# Altium schematic sheet STM32F103RB&DAC&VI.SchDoc
size A4
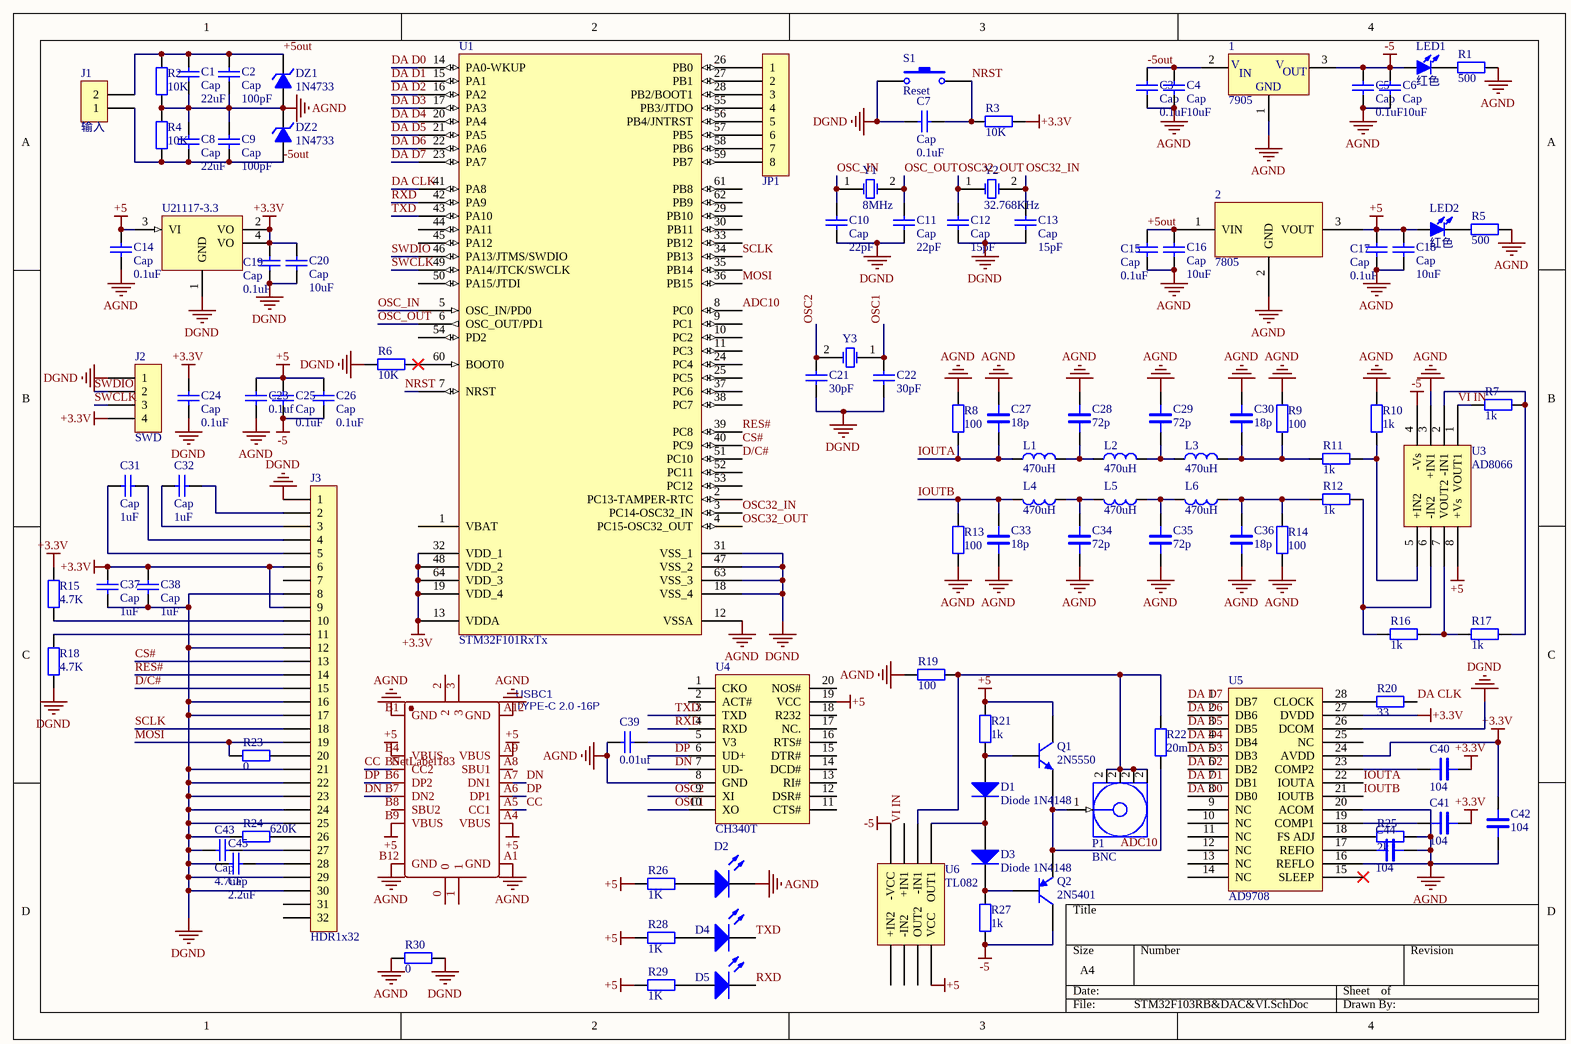
[diagram p0: STM32F103RB&DAC&VI.SchDoc]

## Parts
1  7905  [TO-220AB]
2  7805  [TO-220AB]
C1  Cap  value 22uF  [0603_C]
C2  Cap  value 100pF  [0603_C]
C3  Cap  value 0.1uF  [0603_C]
C4  Cap  value 10uF  [0603_C]
C5  Cap  value 0.1uF  [0603_C]
C6  Cap  value 10uF  [0603_C]
C7  Cap  value 0.1uF  [0603_C]
C8  Cap  value 22uF  [0603_C]
C9  Cap  value 100pF  [0603_C]
C10  Cap  value 22pF  [0603_C]
C11  Cap  value 22pF  [0603_C]
C12  Cap  value 15pF  [0603_C]
C13  Cap  value 15pF  [0603_C]
C14  Cap  value 0.1uF  [0603_C]
C15  Cap  value 0.1uF  [0603_C]
C16  Cap  value 10uF  [0603_C]
C17  Cap  value 0.1uF  [0603_C]
C18  Cap  value 10uF  [0603_C]
C19  Cap  value 0.1uF  [0603_C]
C20  Cap  value 10uF  [0603_C]
C21  value 30pF  [0603_C]  (hidden comment: Cap)
C22  value 30pF  [0603_C]  (hidden comment: Cap)
C23  value 0.1uf  [0603_C]  (hidden comment: Cap)
C24  Cap  value 0.1uF  [0603_C]
C25  Cap  value 0.1uF  [0603_C]
C26  Cap  value 0.1uF  [0603_C]
C27  18p  [0603_C]
C28  72p  [0603_C]
C29  72p  [0603_C]
C30  18p  [0603_C]
C31  Cap  value 1uF  [0603_C]
C32  Cap  value 1uF  [0603_C]
C33  18p  [0603_C]
C34  72p  [0603_C]
C35  72p  [0603_C]
C36  18p  [0603_C]
C37  Cap  value 1uF  [0603_C]
C38  Cap  value 1uF  [0603_C]
C39  value 0.01uf  [0603_C]  (hidden comment: Cap)
C40  104  [0603_C]
C41  104  [0603_C]
C42  104  [0603_C]
C43  Cap  value 4.7uF  [0603_C]
C44  104  [0603_C]
C45  Cap  value 2.2uF  [0603_C]
D1  Diode 1N4148  [DO-35]
D2  LED  [LED 0603B]  (value not drawn)
D3  Diode 1N4148  [DO-35]
D4  LED  [LED 0603B]  (value not drawn)
D5  LED  [LED 0603B]  (value not drawn)
DZ1  1N4733  [DO-41]
DZ2  1N4733  [DO-41]
J1  输入  [PH2.0-WS-2P]
J2  SWD  [PH2.0-WS-4P]
J3  HDR1x32  [FPC0.5 2H-WS-30P]
JP1  FPC1.0-8P  [FPC1.0-2H-WS-8P]  (value not drawn)
L1  470uH  [0805_L]
L2  470uH  [0805_L]
L3  470uH  [0805_L]
L4  470uH  [0805_L]
L5  470uH  [0805_L]
L6  470uH  [0805_L]
LED1  红色  [LED 0603B]
LED2  红色  [LED 0603B]
P1  BNC  [BNC]
Q1  2N5550  [TO-92A]
Q2  2N5401  [TO-92A]
R1  value 500  [0603_R]  (hidden comment: 1W)
R2  10K  [0603_R]
R3  value 10K  [0603_R]  (hidden comment: 1W)
R4  10K  [0603_R]
R5  value 500  [0603_R]  (hidden comment: 1W)
R6  value 10K  [0603_R]  (hidden comment: 1W)
R7  1k  [0603_R]
R8  100  [0603_R]
R9  100  [0603_R]
R10  1k  [0603_R]
R11  1k  [0603_R]
R12  1k  [0603_R]
R13  100  [0603_R]
R14  100  [0603_R]
R15  value 4.7K  [0603_R]  (hidden comment: 1W)
R16  1k  [0603_R]
R17  1k  [0603_R]
R18  value 4.7K  [0603_R]  (hidden comment: 1W)
R19  100  [0603_R]
R20  33  [0603_R]
R21  1k  [0603_R]
R22  20m  [0603_R]
R23  value 0  [0603_R]  (hidden comment: 1W)
R24  value 620K  [0603_R]  (hidden comment: 1W)
R25  2k  [0603_R]
R26  value 1K  [0603_R]  (hidden comment: Res2)
R27  1k  [0603_R]
R28  value 1K  [0603_R]  (hidden comment: Res2)
R29  value 1K  [0603_R]  (hidden comment: Res2)
R30  value 0  [0603_R]  (hidden comment: Res2)
S1  Reset  [3*6*2.5SW-PB]
U1  STM32F101RxTx  [QFP-64-0.5]
U2  1117-3.3  [SOT-223]
U3  AD8066  [SOIC-8_150mil]
U4  CH340T  [SSOP-20_208mil]
U5  AD9708  [SOIC-28_300mil]
U6  TL082  [SOIC-8_150mil]
USBC1  TYPE-C 2.0 -16P  [USB-C-SMD_TYPE-C-USB-5]
Y1  8MHz  [OSC 5032-2P]
Y2  32.768KHz  [OSC 3215-2P]
Y3  XTAL  [OSC 5032-2P]  (value not drawn)

## Nets
+3.3V: C19.2 C20.2 C24.2 C37.2 C38.2 C40.2 C41.2 C42.2 J2.4 J3.6 J3.9 R3.1 R15.2 U1.13(VDDA) U1.19(VDD_4) U1.32(VDD_1) U1.48(VDD_2) U1.64(VDD_3) U2.2(VO) U2.4(VO) U5.24(AVDD) U5.27(DVDD)
+5: 2.3(VOUT) C14.2 C17.2 C18.2 C23.1 C25.2 C26.2 LED2.1(A) Q1.3(C) R21.1 R26.1 R28.1 R29.1 U2.3(VI) U3.8(+Vs) U4.19(VCC) U6.8(VCC) USBC1.A4(VBUS) USBC1.A9(VBUS) USBC1.B4(VBUS) USBC1.B9(VBUS)
-5: 1.3(VOUT) C5.2 C6.2 C25.1 C26.1 LED1.1(A) Q2.3(C) R27.2 U3.4(-Vs) U6.4(-VCC)
AGND: 1.1(GND) 2.2(GND) C1.1 C2.1 C3.1 C4.1 C5.1 C6.1 C8.2 C9.2 C14.1 C15.1 C16.1 C17.1 C18.1 C23.2 C27.2 C28.2 C29.2 C30.2 C33.2 C34.2 C35.2 C36.2 C39.1 C42.1 C44.2 D2.2 DZ1.1(A) DZ2.2(K) R1.1 R2.1 R4.2 R5.1 R8.2 R9.2 R10.1 R13.2 R14.2 R19.1 R25.2 R30.1 U1.12(VSSA) U3.3(+IN1) U4.8(GND) U5.16(REFLO) U5.20(ACOM) USBC1.A1(GND) USBC1.A12(GND) USBC1.B1(GND) USBC1.B12(GND)
DGND: C7.1 C10.1 C11.1 C12.1 C13.1 C19.1 C20.1 C21.2 C22.2 C24.1 C37.1 C38.1 C43.2 C45.2 J2.1 J3.1 J3.8 J3.12 J3.16 J3.17 J3.21 J3.22 J3.23 J3.24 J3.25 J3.29 J3.30 R6.2 R18.1 R24.1 R30.2 S1.1 U1.18(VSS_4) U1.31(VSS_1) U1.47(VSS_2) U1.63(VSS_3) U2.1(GND) U5.26(DCOM)
+5out: 2.1(VIN) C1.2 C2.2 C15.2 C16.2 DZ1.2(K) J1.2 R2.2
-5out: 1.2(VIN) C3.2 C4.2 C8.1 C9.1 DZ2.1(A) J1.1 R4.1
ADC10: P1.1 Q1.1(E) Q2.1(E) R22.1 U1.8(PC0)
CC: USBC1.A5(CC1) USBC1.B5(CC2)  [also labelled NetLabel183]
CS#: J3.13 U1.40(PC9)
D/C#: J3.15 U1.51(PC10)
DA CLK: R20.2 U1.41(PA8)
DA D0: U1.14(PA0-WKUP) U5.8(DB0)
DA D1: U1.15(PA1) U5.7(DB1)
DA D2: U1.16(PA2) U5.6(DB2)
DA D3: U1.17(PA3) U5.5(DB3)
DA D4: U1.20(PA4) U5.4(DB4)
DA D5: U1.21(PA5) U5.3(DB5)
DA D6: U1.22(PA6) U5.2(DB6)
DA D7: U1.23(PA7) U5.1(DB7)
DN: U4.7(UD-) USBC1.A7(DN1) USBC1.B7(DN2)
DP: U4.6(UD+) USBC1.A6(DP1) USBC1.B6(DP2)
IOUTA: C27.1 L1.1 R8.1 U5.22(IOUTA)
IOUTB: C33.1 L4.1 R13.1 U5.21(IOUTB)
MOSI: J3.19 R23.1 U1.36(PB15)
NRST: C7.2 R3.2 S1.2 U1.7(NRST)
OSC1: C22.1 U4.10(XO) Y3.1(OSC1)
OSC2: C21.1 U4.9(XI) Y3.2(OSC2)
OSC32_IN: C13.2 U1.3(PC14-OSC32_IN) Y2.2(OSC2)
OSC32_OUT: C12.2 U1.4(PC15-OSC32_OUT) Y2.1(OSC1)
OSC_IN: C10.2 U1.5(OSC_IN/PD0) Y1.1(OSC1)
OSC_OUT: C11.2 U1.6(OSC_OUT/PD1) Y1.2(OSC2)
RES#: J3.14 U1.39(PC8)
RXD: D5.2 U1.42(PA9) U4.4(RXD)
SCLK: J3.18 U1.34(PB13)
SWCLK: J2.3 U1.49(PA14/JTCK/SWCLK)
SWDIO: J2.2 U1.46(PA13/JTMS/SWDIO)
TXD: D4.2 U1.43(PA10) U4.3(TXD)
VI IN: R7.2 U3.1(VOUT1) U6.3(+IN1)
NetC28_1: C28.1 L1.2 L2.1
NetC29_1: C29.1 L2.2 L3.2
NetC30_1: C30.1 L3.1 R9.1 R11.2
NetC31_1: C31.1 J3.4
NetC31_2: C31.2 J3.5
NetC32_1: C32.1 J3.2
NetC32_2: C32.2 J3.3
NetC34_1: C34.1 L4.2 L5.1
NetC35_1: C35.1 L5.2 L6.2
NetC36_1: C36.1 L6.1 R12.2 R14.1
NetC39_2: C39.2 U4.5(V3)
NetC40_1: C40.1 U5.23(COMP2)
NetC41_1: C41.1 U5.19(COMP1)
NetC43_1: C43.1 J3.27
NetC44_1: C44.1 U5.17(REFIO)
NetC45_1: C45.1 J3.28
NetD1_1: D1.1(A) Q1.2(B) R21.2
NetD1_2: D1.2(K) D3.1(A) U6.1(OUT1)
NetD2_1: D2.1 R26.2
NetD3_2: D3.2(K) Q2.2(B) R27.1
NetD4_1: D4.1 R28.2
NetD5_1: D5.1 R29.2
NetJ3_10: J3.10 R15.1
NetJ3_11: J3.11 R18.2
NetJ3_20: J3.20 R23.2
NetJ3_26: J3.26 R24.2
NetJP1_1: JP1.1 U1.26(PB0)
NetJP1_2: JP1.2 U1.27(PB1)
NetJP1_3: JP1.3 U1.28(PB2/BOOT1)
NetJP1_4: JP1.4 U1.55(PB3/JTDO)
NetJP1_5: JP1.5 U1.56(PB4/JNTRST)
NetJP1_6: JP1.6 U1.57(PB5)
NetJP1_7: JP1.7 U1.58(PB6)
NetJP1_8: JP1.8 U1.59(PB7)
NetLED1_2: LED1.2(K) R1.2
NetLED2_2: LED2.2(K) R5.2
NetP1_2: P1.2 R19.2 R22.2 U6.2(-IN1)
NetR6_1: R6.1 U1.60(BOOT0)
NetR7_1: R7.1 R17.1 U3.2(-IN1)
NetR10_2: R10.2 R11.1 U3.5(+IN2)
NetR12_1: R12.1 R16.2 U3.6(-IN2)
NetR16_1: R16.1 R17.2 U3.7(VOUT2)
NetR20_1: R20.1 U5.28(CLOCK)
NetR25_1: R25.1 U5.18(FS_ADJ)

Not connected (* = marked no-connect by the designer): J3 7 31 32; U1 1(VBAT) 2(PC13-TAMPER-RTC) 9(PC1) 10(PC2) 11(PC3) 24(PC4) 25(PC5) 29(PB10) 30(PB11) 33(PB12) 35(PB14) 37(PC6) 38(PC7) 44(PA11) 45(PA12) 50(PA15/JTDI) 52(PC11) 53(PC12) 54(PD2) 61(PB8) 62(PB9); U4 1(CKO) 2(ACT#) 11(CTS#) 12(DSR#) 13(RI#) 14(DCD#) 15(DTR#) 16(RTS#) 17(NC.) 18(R232) 20(NOS#); U5 9(NC) 10(NC) 11(NC) 12(NC) 13(NC) 14(NC) 15(SLEEP)* 25(NC); U6 5(+IN2) 6(-IN2) 7(OUT2); USBC1 0 1 2 3 A8(SBU1) B8(SBU2)

## Notes on the sheet
- (in symbol 7905) V; IN; OUT

## Library data of the parts
1 = 7905: pin to pad: 1>2 2>1
2 = LM7805
C1-C26 C31 C32 C37-C39 C43 C45 = Cap: Capacitor; Published: 8-Jun-2000; LatestRevisionDate: 17-Jul-2002; LatestRevisionNote: Re-released for DXP Platform.; Publisher: Altium Limited
  C1-C20 C24-C26 C31 C32 C37 C38 C43 C45: PackageReference: RAD-0.3; PackageDescription: Radial Cap, Thru-Hole; 2 Leads; 0.3 in Pin Spacing
C27-C30 C33-C36 C40-C42 C44 = CAP: Capacitor
D1 D3 = Diode 1N4148: High Conductance Fast Diode; Published: 8-Jun-2000; LatestRevisionDate: 17-Jul-2002; LatestRevisionNote: Re-released for DXP Platform.; DatasheetVersion: 1997; PackageReference: DO-35; Publisher: Altium Limited; PackageDescription: Diode, Axial; Body 3.8 x 1.9 mm (LxDia. max), Lead Dia. 0.53 mm (max); Code_JEDEC: DO-204-AH; ComponentLink1Description: Manufacturer Link; ComponentLink1URL: http://www.fairchildsemi.com/; ComponentLink2Description: Datasheet; ComponentLink2URL: http://www.fairchildsemi.com/ds/1N%2F1N4148.pdf
D2 D4 D5 = LED0: Typical INFRARED GaAs LED; Published: 8-Jun-2000; LatestRevisionDate: 08-Jul-2005; LatestRevisionNote: Mech Layer 1 removed.; PackageReference: LED-0; Publisher: Altium Limited
DZ1 DZ2 = 1N4733: 5.1V/1W稳压管; 版权归属: 封装库来自淘宝 ID：黄晶宝石; BOM名称: 5.1V/1W稳压管; 学习资源: www.ooocke.com
J1 = HDR1x2: Connector
J2 = HDR1x4: Connector
J3 = HDR1x32: Connector; pin to pad: 1>30 2>29 3>28 4>27 5>26 6>25 7>24 8>23 9>22 10>21 11>20 12>19 13>18 14>17 15>16 16>15 17>14 18>13 19>12 20>11 21>10 22>9 23>8 24>7 25>6 26>5 27>4 28>3 29>2 30>1
JP1 = FPC-8P: FPC连接器; 版权归属: 源创客; BOM名称: FPC连接器; 学习资源: www.ooocke.com
L1-L6 = INDUCTANCE
LED1 LED2 = LED-SMD: 贴片LED; 版权归属: 封装库来自淘宝 ID：黄晶宝石; BOM名称: 贴片LED; 学习资源: https://shop463601444.taobao.com
Q1 = 2N3904: NPN General Purpose Amplifier; Published: 8-Jun-2000; LatestRevisionDate: 15-Jan-2003; LatestRevisionNote: PCB Footprint 'BCY-W3/D4.7' replaced; DatasheetVersion: 1997; PackageVersion: Sep-1998; PackageReference: TO-92A; Publisher: Altium Limited; PackageDescription: TO, Flat Index; 3 In-Line, Axial Leads; Body Dia. 4.5mm; Leads 0.51 x 0.48 mm (max); ComponentLink1Description: Manufacturer Link; ComponentLink1URL: http://www.fairchildsemi.com/; ComponentLink2Description: Datasheet; ComponentLink2URL: http://www.fairchildsemi.com/ds/2N%2F2N3904.pdf
Q2 = 2N3906: PNP General Purpose Amplifier; Published: 8-Jun-2000; LatestRevisionDate: 15-Jan-2003; LatestRevisionNote: PCB Footprint 'BCY-W3/D4.7' replaced; DatasheetVersion: 1997; PackageVersion: Sep-1998; PackageReference: TO-92A; Publisher: Altium Limited; PackageDescription: TO, Flat Index; 3 In-Line, Axial Leads; Body Dia. 4.5mm; Leads 0.51 x 0.48 mm (max); ComponentLink1Description: Manufacturer Link; ComponentLink1URL: http://www.fairchildsemi.com/; ComponentLink2Description: Datasheet; ComponentLink2URL: http://www.fairchildsemi.com/ds/2N%2F2N3906.pdf
R1 R3 R5 R6 R15 R18 R23 R24 R26 R28-R30 = Res2: Resistor; Published: 8-Jun-2000; LatestRevisionDate: 17-Jul-2002; LatestRevisionNote: Re-released for DXP Platform.; PackageReference: AXIAL-0.4; Publisher: Altium Limited
  R1 R3 R5 R6 R15 R18 R23 R24: PackageDescription: Axial Device, Thru-Hole; 2 Leads; 0.4 in Pin Spacing
R2 R4 R7-R14 R16 R17 R19-R22 R25 R27 = RES: Resistor
S1 = SW-PB: Switch; Published: 24-Mar-1999; LatestRevisionDate: 17-Jul-2002; LatestRevisionNote: Re-released for DXP Platform.; PackageReference: SPST-2; Publisher: Altium Limited; PackageDescription: Switch; 2 Leads
U1 = STM32F101RxTx: MCU
U2 = 1117: Linear Regulator
U3 = AD8066: 高性能、145 MHz FastFET™运算放大器
U5 = AD9708: DAC 8bit
U6 = TL082: 运放
USBC1 = USB2.0 Type-C 16Pin母座: USB2.0 Type-C 母座 16Pin; BOM_Manufacturer: LCSC; BOM_Supplier: LCSC; BOM_Manufacturer Part: -; spicePre: U; spiceSymbolName: TYPE-C 3.1 -16P_C168689
Y1-Y3 = XTAL: Crystal Oscillator; Published: 8-Jun-2000; LatestRevisionDate: 17-Jul-2002; LatestRevisionNote: Re-released for DXP Platform.; PackageReference: R38; Publisher: Altium Limited
  Y1 Y2: PackageDescription: Crystal, Thru-Hole; 2 Leads; Body 3.1 x 8.2 mm (Dia.xH)